# EAGLE design xBeeMSP (EAGLE 9.2.2)
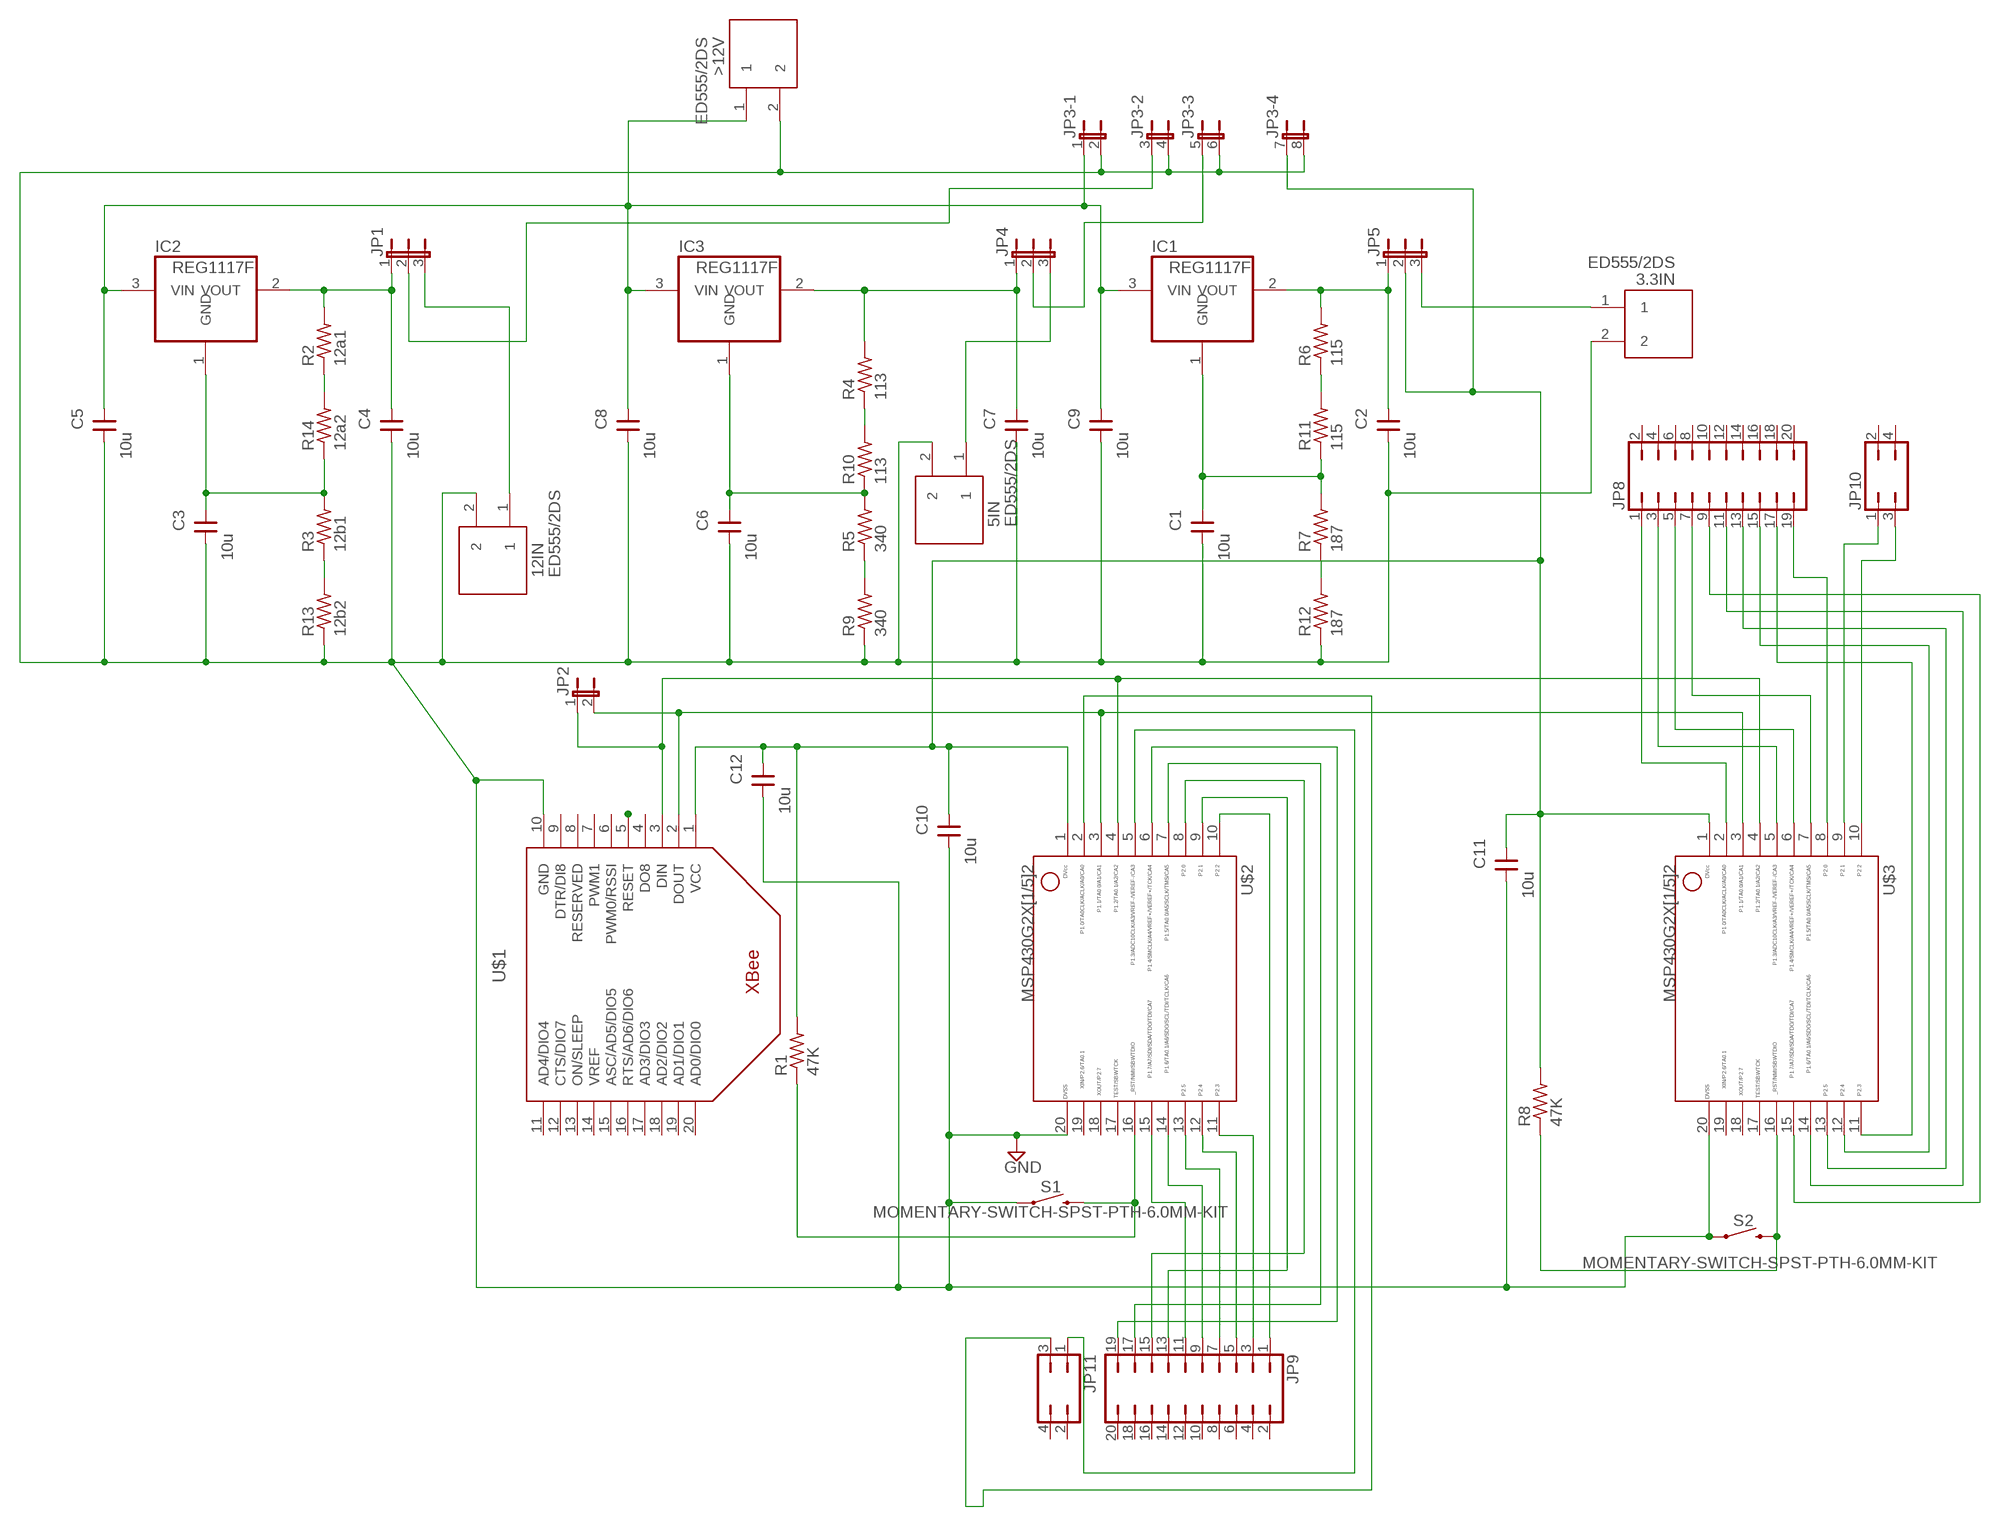
[diagram p0: schematic, sheet 1]

## Parts
3.3IN  ED555/2DS  [ED555/2DS]
5IN  ED555/2DS  [ED555/2DS]
12IN  ED555/2DS  [ED555/2DS]
>12V  ED555/2DS  [ED555/2DS]
C1  10u  CNP-C020-035X018  [C020-035X018]
C2  10u  CNP-C020-035X018  [C020-035X018]
C3  10u  CNP-C020-035X018  [C020-035X018]
C4  10u  CNP-C020-035X018  [C020-035X018]
C5  10u  CNP-C020-035X018  [C020-035X018]
C6  10u  CNP-C020-035X018  [C020-035X018]
C7  10u  CNP-C020-035X018  [C020-035X018]
C8  10u  CNP-C020-035X018  [C020-035X018]
C9  10u  CNP-C020-035X018  [C020-035X018]
C10  10u  CNP-C020-035X018  [C020-035X018]
C11  10u  CNP-C020-035X018  [C020-035X018]
C12  10u  CNP-C020-035X018  [C020-035X018]
IC1  REG1117F  [DD-3]
IC2  REG1117F  [DD-3]
IC3  REG1117F  [DD-3]
JP1  JP2E  [JP2]
JP2  JP1E  [JP1]
JP3  JP4QE  [JP4Q]
JP4  JP2E  [JP2]
JP5  JP2E  [JP2]
JP8  JP10Q  [JP10Q]
JP9  JP10Q  [JP10Q]
JP10  JP2Q  [JP2Q]
JP11  JP2Q  [JP2Q]
R1  47K  R-US_0207/10  [0207/10]
R2  12a1  R-US_0207/10  [0207/10]
R3  12b1  R-US_0207/10  [0207/10]
R4  113  R-US_0207/10  [0207/10]
R5  340  R-US_0207/10  [0207/10]
R6  115  R-US_0207/10  [0207/10]
R7  187  R-US_0207/10  [0207/10]
R8  47K  R-US_0207/10  [0207/10]
R9  340  R-US_0207/10  [0207/10]
R10  113  R-US_0207/10  [0207/10]
R11  115  R-US_0207/10  [0207/10]
R12  187  R-US_0207/10  [0207/10]
R13  12b2  R-US_0207/10  [0207/10]
R14  12a2  R-US_0207/10  [0207/10]
S1  MOMENTARY-SWITCH-SPST-PTH-6.0MM-KIT  [TACTILE_SWITCH_PTH_6.0MM_KIT]
S2  MOMENTARY-SWITCH-SPST-PTH-6.0MM-KIT  [TACTILE_SWITCH_PTH_6.0MM_KIT]
U$1  XBEE  [XBEE]
U$2  G2X[1/5]2---N20  [N20]
U$3  G2X[1/5]2---N20  [N20]

## Nets
3.3VOUT: C2.2 IC1.2(VOUT) JP5.1 R6.2
5VOUT: C7.2 IC3.2(VOUT) JP4.1 R4.2
12VOUT: C4.2 IC2.2(VOUT) JP1.1 R2.2
GND: 3.3IN.2 5IN.2 12IN.2 >12V.2 C1.1 C2.1 C3.1 C4.1 C5.1 C6.1 C7.1 C8.1 C9.1 C10.1 C11.1 C12.1 JP3.2 JP3.4 JP3.6 JP3.8 R9.1 R12.1 R13.1 S1.1 S2.1 U$1.5(RESET) U$1.10(GND) U$2.20 U$3.20
N$1: JP2.2 U$1.2(DOUT) U$2.3 U$3.3
N$2: JP9.3 U$2.11
N$3: JP2.1 U$1.3(DIN) U$2.4 U$3.4
N$4: R1.1 S1.3 U$2.16
N$5: JP9.1 U$2.10
N$6: JP9.13 U$2.9
N$7: JP9.15 U$2.8
N$8: JP9.17 U$2.7
N$9: JP9.5 U$2.12
N$10: JP9.19 U$2.6
N$11: JP11.1 U$2.5
N$12: JP11.3 U$2.2
N$13: JP9.7 U$2.13
N$14: JP9.9 U$2.14
N$15: R8.1 S2.3 U$3.16
N$16: JP9.11 U$2.15
N$17: JP8.1 U$3.2
N$18: JP8.3 U$3.5
N$19: JP3.5 JP4.2
N$20: JP8.5 U$3.6
N$21: R2.1 R14.2
N$22: JP8.7 U$3.7
N$23: R4.1 R10.2
N$27: JP8.17 U$3.11
N$28: JP8.15 U$3.12
N$29: C6.2 IC3.1(GND) R5.2 R10.1
N$30: JP8.13 U$3.13
N$31: JP8.11 U$3.14
N$32: JP8.9 U$3.15
N$33: R6.1 R11.2
N$34: R5.1 R9.2
N$35: C1.2 IC1.1(GND) R7.2 R11.1
N$36: R7.1 R12.2
N$37: C3.2 IC2.1(GND) R3.2 R14.1
N$38: 12IN.1 JP1.3
N$39: R3.1 R13.2
N$40: 5IN.1 JP4.3
N$41: JP8.19 U$3.8
N$42: >12V.1 C5.2 C8.2 C9.2 IC1.3(VIN) IC2.3(VIN) IC3.3(VIN) JP3.1
N$43: 3.3IN.1 JP5.3
N$44: JP10.1 U$3.9
N$45: JP10.3 U$3.10
N$46: JP1.2 JP3.3
VCC: C10.2 C11.2 C12.2 JP3.7 JP5.2 R1.2 R8.2 U$1.1(VCC) U$2.1 U$3.1
Unconnected: JP8.2 JP8.4 JP8.6 JP8.8 JP8.10 JP8.12 JP8.14 JP8.16 JP8.18 JP8.20 JP9.2 JP9.4 JP9.6 JP9.8 JP9.10 JP9.12 JP9.14 JP9.16 JP9.18 JP9.20 JP10.2 JP10.4 JP11.2 JP11.4 U$1.4(DO8) U$1.6(PWM0/RSSI) U$1.7(PWM1) U$1.8(RESERVED) U$1.9(DTR/DI8) U$1.11(AD4/DIO4) U$1.12(CTS/DIO7) U$1.13(ON/SLEEP) U$1.14(VREF) U$1.15(ASC/AD5/DIO5) U$1.16(RTS/AD6/DIO6) U$1.17(AD3/DIO3) U$1.18(AD2/DIO2) U$1.19(AD1/DIO1) U$1.20(AD0/DIO0) U$2.17 U$2.18 U$2.19 U$3.17 U$3.18 U$3.19

## Library data of the parts
3.3IN 5IN 12IN >12V = DC_LOAD_AU:ED555/2DS: 2-Pin Terminal Block 3.5mm pitch 6A
C1-C12 = cap-master:CNP-: NON-POLARIZED CAP
IC1-IC3 = burr-brown:REG1117: 800mA and 1A Low Dropout (LDO) Positive Regulator 1.8V, 2.5V, 2.85V, 3.3V, 5V, and Adj; MF: TEXAS INSTRUMENTS; MPN: REG1117FAKTTT; OC_FARNELL: 1296120; OC_NEWARK: 87H2562
JP1 JP4 JP5 = jumper:JP2E: JUMPER
JP2 = jumper:JP1E: JUMPER
JP3 = jumper:JP4QE: JUMPER
JP8 JP9 = jumper:JP10Q: JUMPER
JP10 JP11 = jumper:JP2Q: JUMPER
R1-R14 = resistor:R-US_: RESISTOR, American symbol
S1 S2 = SparkFun-Switches:MOMENTARY-SWITCH-SPST: Momentary Switch (Pushbutton) - SPST Normally-open (NO) SPST momentary switches (buttons, pushbuttons). Variants PTH-12MM - 12mm square, through-hole Momentary Pushbutton Switch - 12mm Square <https://www.sparkfun.com/products/9190> (COM-09190) PTH-6.0MM, PTH-6.0MM-KIT - 6.0mm square, through-hole Mini Pushbutton Switch <https://www.sparkfun.com/products/97> (COM-00097) KIT package intended for soldering kit's - only one side of pads' copper is exposed. PTH-RIGHT-ANGLE-KIT - Right-angle, through-hole Right Angle Tactile Button <https://www.sparkfun.com/products/10791> - Used on SparkFun BigTime Watch Kit <https://www.sparkfun.com/products/11734> SMD-12MM - 12mm square, surface-mount Tactile Button - SMD (12mm) <https://www.sparkfun.com/products/12993> (COM-12993) Used on SparkFun PicoBoard <https://www.sparkfun.com/products/11888> SMD-4.5MM - 4.5mm Square Trackball Switch Used on SparkFun Blackberry Trackballer Breakout <https://www.sparkfun.com/products/13169> SMD-4.6MMX2.8MM - 4.60mm x 2.80mm, surface mount Used on SparkFun SAMD21 Mini Breakout <https://www.sparkfun.com/products/13664> SMD-5.2MM, SMD-5.2-REDUNDANT - 5.2mm square, surface-mount Mini Pushbutton Switch - SMD <https://www.sparkfun.com/products/8720> (COM-08720) Used on Arduino Pro Mini <https://www.sparkfun.com/products/11114> REDUNDANT package connects both switch circuits together SMD-6.0X3.5MM - 6.0 x 3.5mm, surface mount Momentary Reset Switch SMD <https://www.sparkfun.com/products/8229> (COM-08229) SMD-6.2MM-TALL - 6.2mm square, surface mount Tactile Button - SMD (6mm) <https://www.sparkfun.com/products/12992> Used on SparkFun Digital Sandbox <https://www.sparkfun.com/products/12651> SMD-RIGHT-ANGLE - Right-angle, surface mount Used on SparkFun Block for Intel® Edison - Arduino <https://www.sparkfun.com/products/13036>; PROD_ID: SWCH-08441; SF_SKU: COM-00097
U$1 = adafruit:XBEE
U$2 U$3 = TI_MSP430_v16:G2X[1/5]2---N20: MSP430G2X[1/5]2 MSP430G2x52, MSP430G2x12 PDIP (N) 20 Pin Package http://focus.ti.com/docs/prod/folders/print/msp430g2452.html

## Board
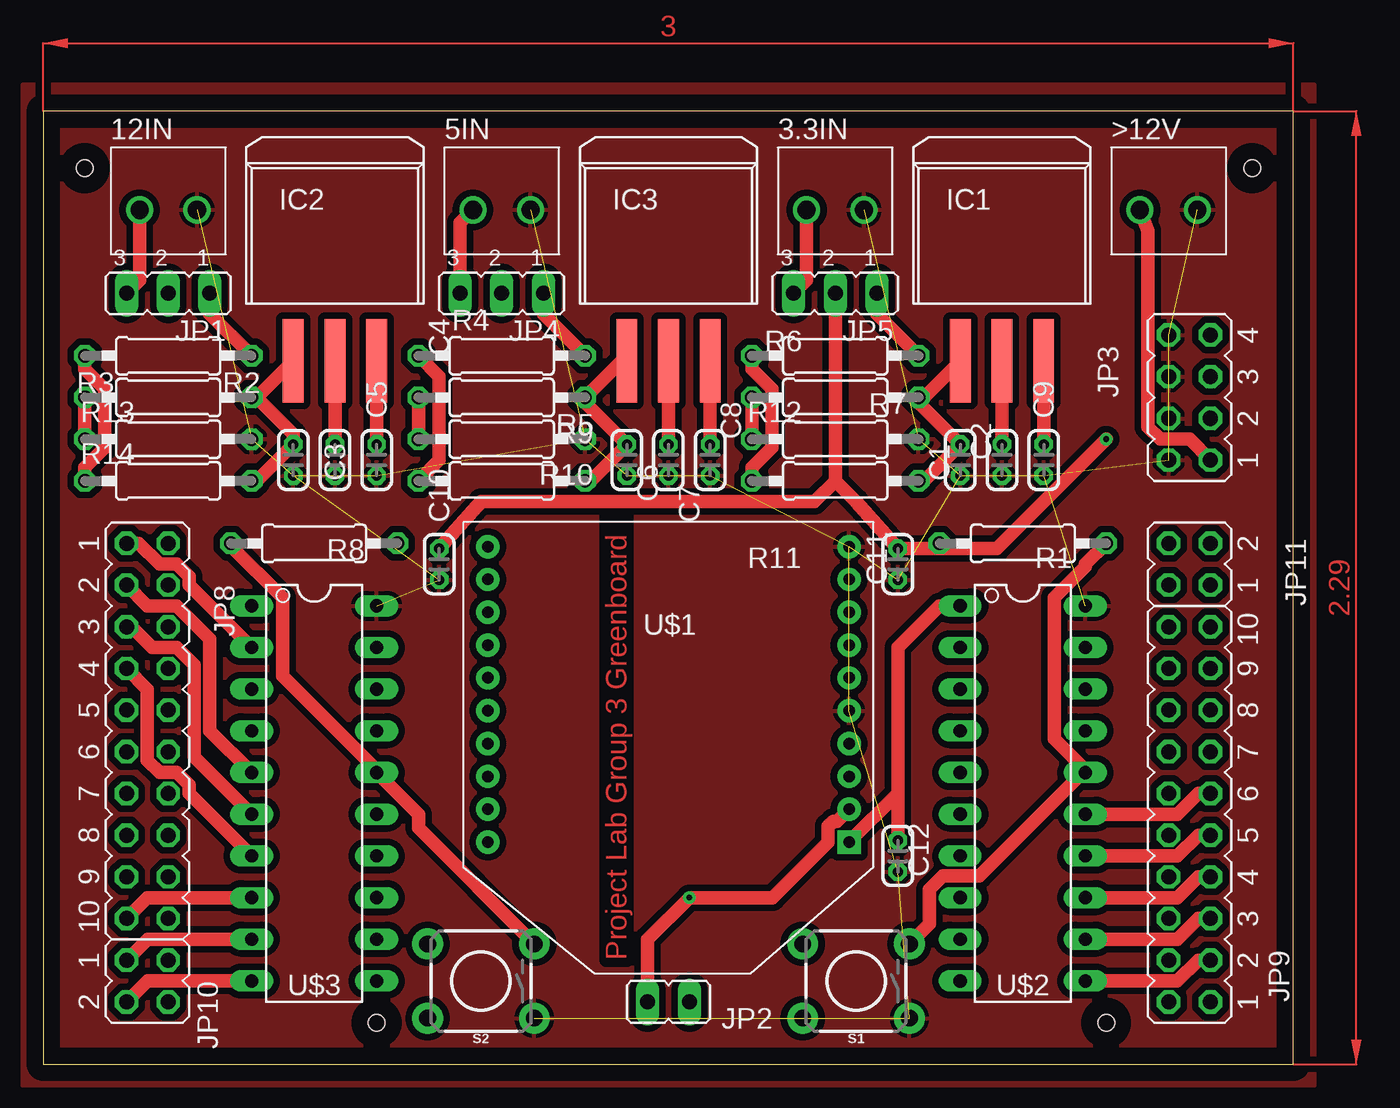
[diagram p1: board, top side]
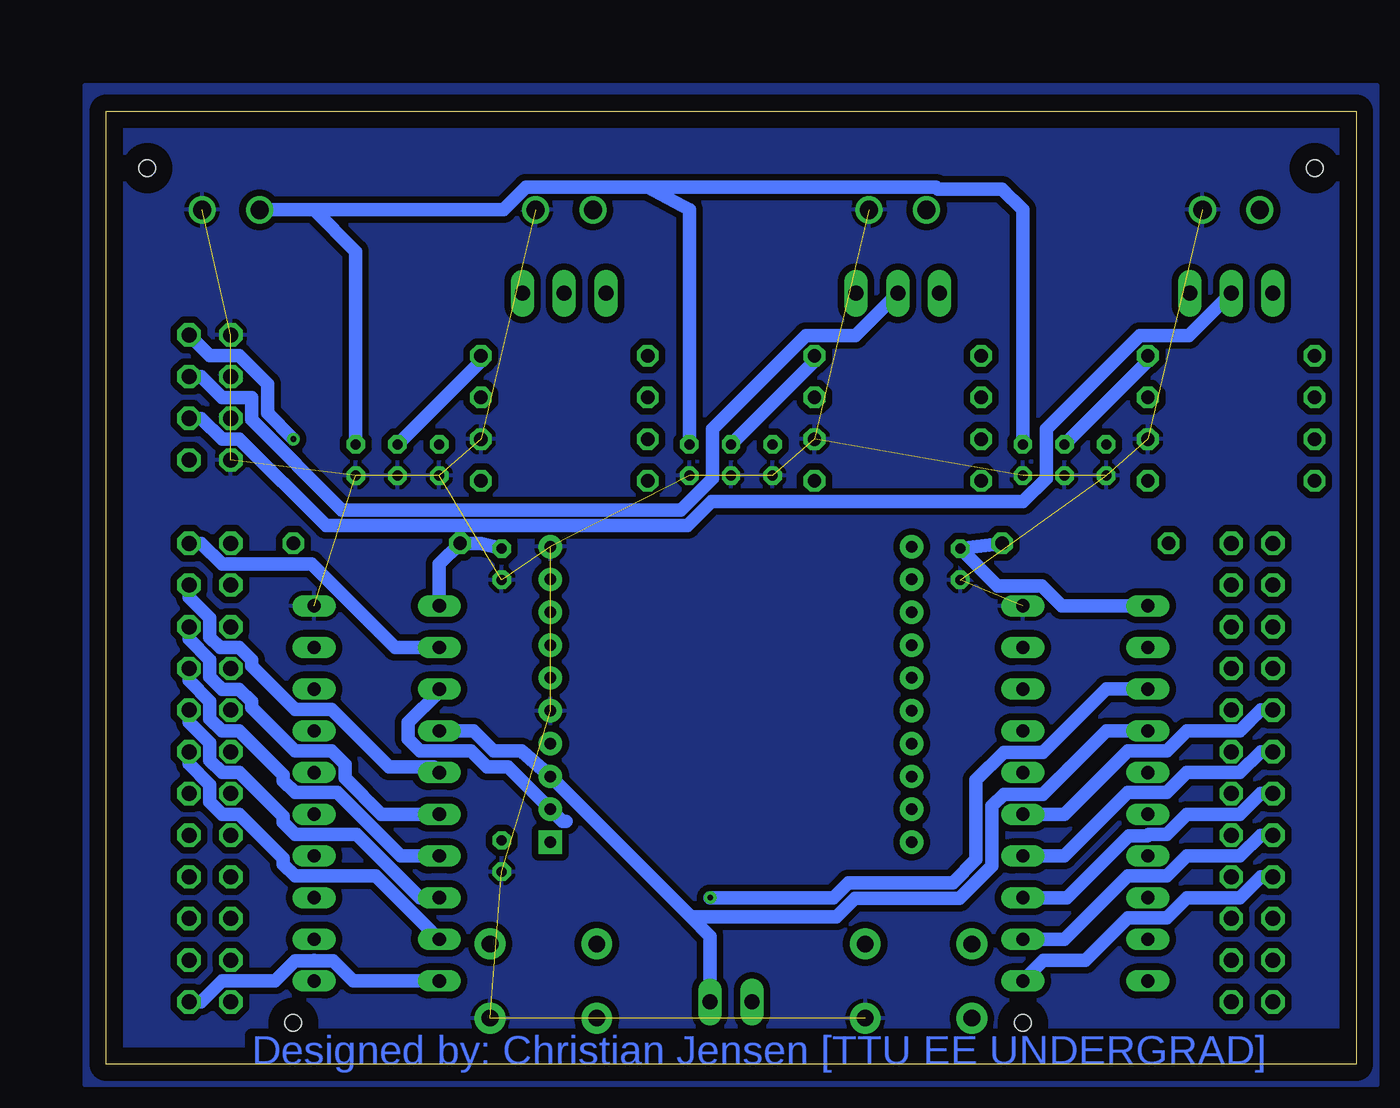
[diagram p2: board, bottom side, seen from below]

Size 76.18 x 58.09 mm. Coordinates in mm from the lower left corner, seen from the top.
Outline: 0,0 76.18,0 76.18,58.09 0,58.09 0,0
Copper layers (1*16): Top 0.035mm / dielectric 1.5mm / Bottom 0.035mm
Design rules "default": minimum track width 6mil, minimum drill 0.35mm, track to track 6mil, track to pad 6mil, pad to pad 6mil, via to via 6mil, smd to smd 6mil, copper to edge 40mil, drill to drill 6mil, minimum pad ring 10mil, minimum via ring 8mil, stop-mask expansion 4mil, vias tented up to drill 0mil, thermal gap 10mil
Holes 1 mm at 2.54,54.61 73.66,54.61 64.77,2.54 20.32,2.54

### Footprints (pad centres in the part's own frame; a part is rotated, then mirrored left to right if it is on the bottom)
ED555/2DS = drill 1.1: 1 -1.75,0; 2 1.75,0
C020-035X018 = drill 0.61 pad 1.016 octagon: 1 -0.953,0; 2 0.953,0
DD-3 = smd 1.27 x 5.08: 1 -2.54,-7.938; 2 0,-7.938; 3 2.54,-7.938
JP2 = drill 0.914 long: 1 -2.54,0; 2 0,0; 3 2.54,0
JP1 = drill 0.914 long: 1 0,-1.27; 2 0,1.27
JP4Q = drill 0.914 octagon: 1 -3.81,-1.27; 2 -3.81,1.27; 3 -1.27,-1.27; 4 -1.27,1.27; 5 1.27,-1.27; 6 1.27,1.27; 7 3.81,-1.27; 8 3.81,1.27
JP10Q = drill 0.914 octagon: 1 -11.43,-1.27; 2 -11.43,1.27; 3 -8.89,-1.27; 4 -8.89,1.27; 5 -6.35,-1.27; 6 -6.35,1.27; 7 -3.81,-1.27; 8 -3.81,1.27; 9 -1.27,-1.27; 10 -1.27,1.27; 11 1.27,-1.27; 12 1.27,1.27; 13 3.81,-1.27; 14 3.81,1.27; 15 6.35,-1.27; 16 6.35,1.27; 17 8.89,-1.27; 18 8.89,1.27; 19 11.43,-1.27; 20 11.43,1.27
JP2Q = drill 0.914 octagon: 1 -1.27,-1.27; 2 -1.27,1.27; 3 1.27,-1.27; 4 1.27,1.27
0207/10 = drill 0.813 octagon: 1 -5.08,0; 2 5.08,0
TACTILE_SWITCH_PTH_6.0MM_KIT = drill 1.016 pad 1.88: 1 -3.251,2.261; 2 3.251,2.261; 3 -3.251,-2.261; 4 3.251,-2.261
XBEE = drill 0.7 pad 1.422 square: 1 -11,5.5 | drill 0.7 pad 1.422: 2 -11,3.5; 3 -11,1.5; 4 -11,-0.5; 5 -11,-2.5; 6 -11,-4.5; 7 -11,-6.5; 8 -11,-8.5; 9 -11,-10.5; 10 -11,-12.5; 11 11,-12.5; 12 11,-10.5; 13 11,-8.5; 14 11,-6.5; 15 11,-4.5; 16 11,-2.5; 17 11,-0.5; 18 11,1.5; 19 11,3.5; 20 11,5.5
N20 = drill 0.813 long: 1 -11.435,-3.81; 2 -8.895,-3.81; 3 -6.355,-3.81; 4 -3.815,-3.81; 5 -1.275,-3.81; 6 1.265,-3.81; 7 3.805,-3.81; 8 6.345,-3.81; 9 8.885,-3.81; 10 11.425,-3.81; 11 11.425,3.81; 12 8.885,3.81; 13 6.345,3.81; 14 3.805,3.81; 15 1.265,3.81; 16 -1.275,3.81; 17 -3.815,3.81; 18 -6.355,3.81; 19 -8.895,3.81; 20 -11.435,3.81

### Placement (x,y rotation side)
3.3IN  48.26,52.07 0 top
5IN  27.94,52.07 0 top
12IN  7.62,52.07 0 top
>12V  68.58,52.07 0 top
C1  55.88,36.83 90 top
C2  58.42,36.83 90 top
C3  15.24,36.83 90 top
C4  17.78,36.83 90 top
C5  20.32,36.83 90 top
C6  35.56,36.83 90 top
C7  38.1,36.83 90 top
C8  40.64,36.83 90 top
C9  60.96,36.83 90 top
C10  24.13,30.48 90 top
C11  52.07,30.48 90 top
C12  52.07,12.7 90 top
IC1  58.42,50.8 0 top
IC2  17.78,50.8 0 top
IC3  38.1,50.8 0 top
JP1  7.62,46.99 180 top
JP2  38.1,3.81 90 top
JP3  69.85,40.64 90 top
JP4  27.94,46.99 180 top
JP5  48.26,46.99 180 top
JP8  6.35,20.32 270 top
JP9  69.85,15.24 90 top
JP10  6.35,5.08 270 top
JP11  69.85,30.48 90 top
R1  59.69,31.75 180 top
R2  7.62,43.18 0 top
R3  7.62,40.64 0 top
R4  27.94,43.18 0 top
R5  27.94,40.64 0 top
R6  48.26,43.18 0 top
R7  48.26,40.64 0 top
R8  16.51,31.75 0 top
R9  27.94,38.1 180 top
R10  27.94,35.56 180 top
R11  48.26,35.56 180 top
R12  48.26,38.1 180 top
R13  7.62,38.1 180 top
R14  7.62,35.56 180 top
S1  49.53,5.08 180 top
S2  26.67,5.08 180 top
U$1  38.1,19.05 180 top
U$2  59.69,16.51 270 top
U$3  16.51,16.51 270 top

### Tracks (layer width: path | path; a pad name or v marks a point on that pad's centre or on a via)
3.3VOUT
  Top 0.813: C2.2 IC1.2 | R6.2 50.8,45.72 JP5.1
  Bottom 0.813: C2.2 53.34,42.86 R6.2
5VOUT
  Top 0.813: R4.2 30.48,45.72 JP4.1 | IC3.2 C7.2
  Bottom 0.813: C7.2 33.02,42.86 R4.2
12VOUT
  Top 0.813: R2.2 10.16,45.72 JP1.1 | IC2.2 C4.2
  Bottom 0.813: C4.2 12.7,42.86 R2.2
GND  (28 unrouted)
  pour Bottom (isolate 0.406): -1.27,59.69 -1.27,-1.27 77.47,-1.27 77.47,59.69
  pour Top (isolate 0.406): -1.27,59.69 -1.27,-1.27 77.47,-1.27 77.47,59.69
N$1  (via drill 0.35)
  Top 0.813: U$1.2 48.37,14.82 48.16,14.82 47.83,14.49 47.83,13.54 44.45,10.16 v39.37,10.16 36.83,7.62 JP2.2
  Bottom 0.813: 48.16,14.82 48.37,14.82 U$1.2 51.69,18.14 52.98,18.14 53.95,19.11 57.05,19.11 57.76,19.82 57.76,20.83 55.88,22.71 U$2.3 | v39.37,10.16 31.86,10.16 30.94,11.07 24.58,11.07 23.16,12.49 23.16,17.32 21.48,19 19.1,19 15.24,22.86 U$3.3
N$2
  Top 0.813: U$2.11 68.05,5.09 68.05,5.08 69.11,5.08 70.38,6.35 JP9.3
N$3
  Bottom 0.813: 40.54,8.99 U$1.3 50.8,19.05 50.85,19.1 52.58,19.1 53.8,20.32 U$2.4 | 40.54,8.99 39.37,7.82 JP2.1 | 40.54,8.99 31.66,8.99 30.54,10.11 24.18,10.11 22.2,12.09 22.2,15.75 21.48,16.46 19.1,16.46 15.24,20.32 U$3.4
N$4
  Top 0.813: S1.3 54,8.56 54,10.67 54.82,11.49 57.05,11.49 63.34,17.79 U$2.16 63.5,17.94 61.62,19.82 61.62,28.45 63.5,30.33 63.5,30.48 R1.1
N$5
  Bottom 0.813: JP9.1 70.38,3.81 69.11,5.08 65.89,5.08 64.66,6.3 63.55,6.3 63.5,6.35 63.45,6.3 62.34,6.3 61.12,5.09 U$2.10
N$6
  Bottom 0.813: U$2.9 59.74,11.49 64.66,11.49 65.38,12.2 65.38,12.57 68.05,15.24 69.11,15.24 69.85,15.98 69.85,17.04 71.12,18.31 JP9.13
N$7
  Bottom 0.813: U$2.8 57.05,10.16 60.92,14.03 64.66,14.03 65.38,14.74 65.38,15.11 68.05,17.78 69.11,17.78 69.85,18.52 69.85,19.58 71.12,20.85 JP9.15
N$8
  Bottom 0.813: U$2.7 58.23,12.7 62.09,16.57 64.66,16.57 65.38,17.28 65.38,17.65 68.05,20.32 69.11,20.32 69.85,21.06 69.85,22.12 71.12,23.39 JP9.17
N$9
  Top 0.813: U$2.12 68.05,7.62 69.11,7.62 70.38,8.89 JP9.5
N$10
  Bottom 0.813: U$2.6 59.41,15.25 61.62,17.46 61.62,18.29 62.44,19.11 64.66,19.11 67.31,21.75 67.31,22.12 68.05,22.86 69.11,22.86 69.85,23.6 69.85,24.66 71.12,25.93 JP9.19
N$11
  Bottom 0.813: U$2.5 56.24,18.14 58.93,18.14 62.44,21.65 64.66,21.65 67.31,24.29 67.31,24.66 68.05,25.4 69.23,25.4 69.85,26.02 69.85,27.2 71.12,28.47 JP11.1
N$12
  Bottom 0.813: U$2.2 58.58,25.4 63.65,30.48 69.11,30.48 70.38,31.75 JP11.3
N$13
  Top 0.813: U$2.13 68.05,10.16 69.11,10.16 70.38,11.43 JP9.7
N$14
  Top 0.813: U$2.14 68.05,12.7 69.11,12.7 70.38,13.97 JP9.9
N$15
  Top 0.813: R8.1 11.43,31.6 14.58,28.45 14.58,23.68 20.32,17.94 U$3.16 22.86,15.25 22.86,14.4 S2.3
N$16
  Top 0.813: U$2.15 68.05,15.25 68.05,15.24 69.11,15.24 70.38,16.51 JP9.11
N$17
  Top 0.813: U$3.2 8.89,29.21 8.89,29.74 8.15,30.48 7.09,30.48 5.82,31.75 JP8.1
N$18
  Top 0.813: U$3.5 10.16,20.32 10.16,25.93 8.15,27.94 6.35,27.94 JP8.3
N$19
  Bottom 0.813: 39.22,35.71 39.37,35.56 | JP4.2 30.53,44.4 33.52,44.4 39.22,38.71 39.22,35.71 | 39.22,35.71 39.23,35.71 41.14,33.8 61.82,33.8 67.31,39.28 67.31,40.64 69.11,40.64 70.38,41.91 JP3.5
N$20
  Top 0.813: U$3.6 9.2,18.75 9.2,24.35 8.15,25.4 6.66,25.4 5.38,26.67 JP8.5
N$21
  Top 0.813: R2.1 2.54,42.36 3.76,41.14 3.76,37.59 2.54,36.38 R14.2
N$22
  Top 0.813: U$3.7 8.89,16.51 8.89,17.04 8.15,17.78 7.09,17.78 6.35,18.52 6.35,22.86 JP8.7
N$23
  Top 0.813: R10.2 24.13,36.83 24.13,41.91 R4.1
N$27
  Bottom 0.813: U$3.11 19.05,6.35 16.51,6.35 13.91,8.95 11.54,8.95 10.32,10.16 7.09,10.16 5.82,11.43 JP8.17
N$28
  Bottom 0.813: U$3.12 17.77,7.62 13.91,11.49 11.54,11.49 10.32,12.7 7.09,12.7 5.82,13.97 JP8.15
N$29
  Top 0.813: IC3.1 35.24,42.86 R5.2 33.02,40.32 C6.2 33.34,35.56 R10.1
N$30
  Bottom 0.813: U$3.13 17.62,10.16 13.87,13.92 12.75,13.92 12.64,14.03 11.54,14.03 10.32,15.24 7.09,15.24 5.82,16.51 JP8.13
N$31
  Bottom 0.813: U$3.14 17.77,12.7 13.91,16.57 11.54,16.57 10.32,17.78 7.09,17.78 5.82,19.05 JP8.11
N$32
  Bottom 0.813: U$3.15 17.77,15.25 13.91,19.11 11.54,19.11 10.32,20.32 7.09,20.32 5.82,21.59 JP8.9
N$33
  Top 0.813: R6.1 43.18,42.36 44.4,41.14 44.4,37.59 43.18,36.38 R11.2
N$34
  Top 0.813: R5.1 R9.2
N$35
  Top 0.813: IC1.1 53.66,40.64 R7.2 53.34,40.32 C1.2 53.66,35.56 R11.1
N$36
  Top 0.813: R7.1 R12.2
N$37
  Top 0.813: IC2.1 13.02,40.64 | 13.02,40.64 R3.2 | 13.02,40.64 15.24,38.42 C3.2 13.02,35.56 R14.1
N$38
  Top 0.813: 12IN.1 5.87,47.78 JP1.3
N$39
  Top 0.813: R3.1 R13.2
N$40
  Top 0.813: JP4.3 25.4,51.28 5IN.1
N$41
  Top 0.813: U$3.8 6.35,10.16 JP8.19
N$42
  Top 0.813: C8.2 IC3.3 | C9.2 IC1.3 | C5.2 IC2.3 | JP3.1 69.85,38.1 68.05,38.1 67.31,38.84 67.31,50.8 >12V.1
  Bottom 0.813: >12V.1 63.5,52.07 | 63.5,52.07 51.97,52.07 50.58,53.45 43.18,53.45 | 43.18,53.45 25.62,53.45 25.5,53.34 21.59,53.34 20.32,52.07 C5.2 | 43.18,53.45 40.64,52.07 C8.2 | C9.2 60.96,49.53 63.5,52.07
N$43
  Top 0.813: JP5.3 46.51,47.78 3.3IN.1
N$44
  Top 0.813: JP10.1 6.36,7.62 7.09,7.62 8.15,7.62 U$3.9
N$45
  Top 0.813: JP10.3 6.36,5.09 7.09,5.09 7.09,5.08 8.15,5.08 8.15,5.09 U$3.10
N$46
  Bottom 0.813: JP1.2 10.21,44.4 13.21,44.4 18.9,38.71 18.9,35.71 20.32,34.29 39.28,34.29 40.74,32.83 62.78,32.83 68.05,38.1 68.58,38.1 69.11,38.1 70.38,39.37 JP3.3
VCC  (via drill 0.35)  (2 unrouted)
  Top 0.813: U$2.1 54.61,27.94 52.07,25.4 52.07,16.51 | 52.07,16.51 C12.2 | U$1.1 52.07,16.51 | JP5.2 48.26,35.56 | C10.2 26.67,34.29 46.99,34.29 48.26,35.56 | 48.26,35.56 49.53,34.29 C11.2 58.1,31.43 v64.77,38.1
  Bottom 0.813: U$3.1 16.51,27.94 17.93,27.94 19.16,29.16 21.86,29.16 C10.2 R8.2 | U$2.1 55.88,30.48 R1.2 53.34,31.75 C11.2 | v64.77,38.1 66.34,39.68 66.34,41.47 68.05,43.18 69.85,43.18 JP3.7
(copper drawn outside any net)
  shapes: Top area x2

### Text on the board
Top: Project Lab Group 3 Greenboard
Bottom: Designed by: Christian Jensen [TTU EE UNDERGRAD]